# EAGLE design BTP_sensors_and_outputs_V1 (EAGLE 7.7.0)
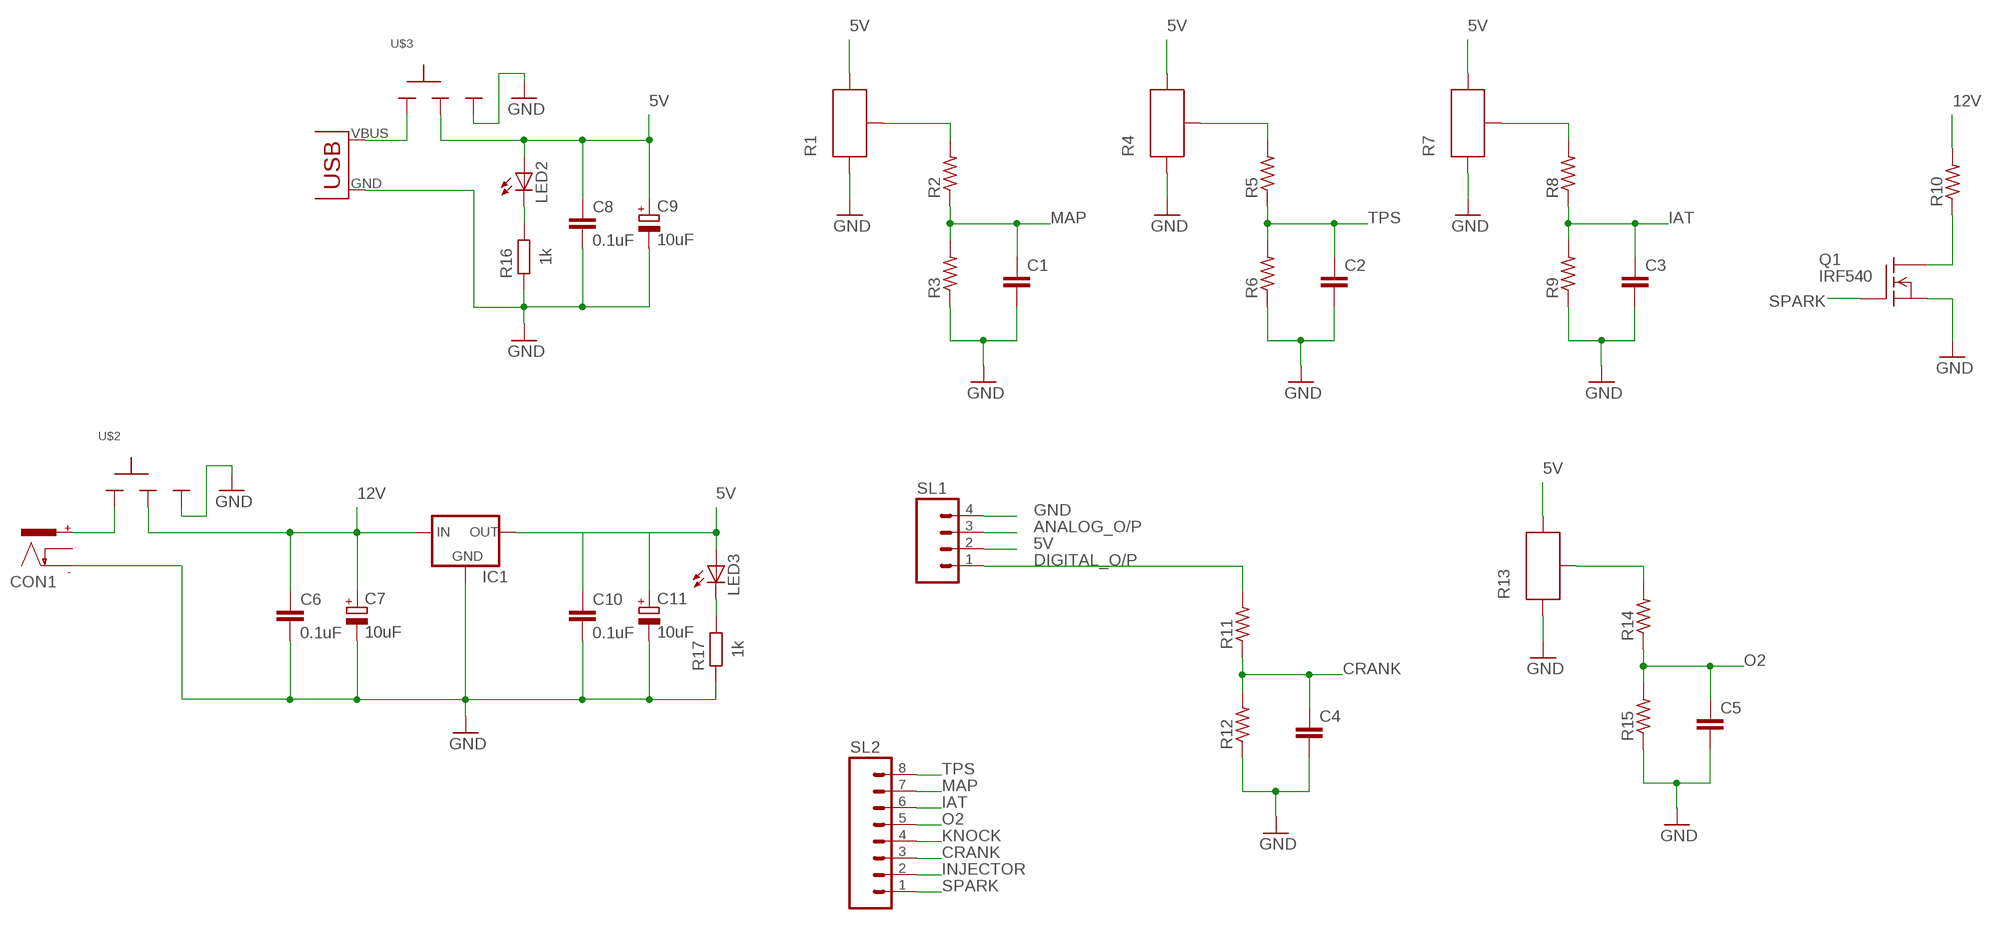
[diagram p0: schematic, sheet 1]

## Parts
C1  CAPACITOR-NON_POLAR025-025X050  [C025-025X050]
C2  CAPACITOR-NON_POLAR025-025X050  [C025-025X050]
C3  CAPACITOR-NON_POLAR025-025X050  [C025-025X050]
C4  CAPACITOR-NON_POLAR025-025X050  [C025-025X050]
C5  CAPACITOR-NON_POLAR025-025X050  [C025-025X050]
C6  0.1uF  C-EU025-025X050  [C025-025X050]
C7  10uF  CPOL-EUE2.5-5  [E2,5-5]
C8  0.1uF  C-EU025-025X050  [C025-025X050]
C9  10uF  CPOL-EUE2.5-5  [E2,5-5]
C10  0.1uF  C-EU025-025X050  [C025-025X050]
C11  10uF  CPOL-EUE2.5-5  [E2,5-5]
CON1  POWER_CON  [NEB21R]
IC1  V_REG_78XXSINK  [TO220-IGO]
LED2  LED3MM  [LED3MM]
LED3  LED3MM  [LED3MM]
Q1  IRF540  [TO220]
R1  POTNORMAL  [RJ9W]
R2  RESISTOR-1/8W  [0204/7]
R3  RESISTOR-1/8W  [0204/7]
R4  POTNORMAL  [RJ9W]
R5  RESISTOR-1/8W  [0204/7]
R6  RESISTOR-1/8W  [0204/7]
R7  POTNORMAL  [RJ9W]
R8  RESISTOR-1/8W  [0204/7]
R9  RESISTOR-1/8W  [0204/7]
R10  RESISTOR-1/8W  [0204/7]
R11  RESISTOR-1/8W  [0204/7]
R12  RESISTOR-1/8W  [0204/7]
R13  POTNORMAL  [RJ9W]
R14  RESISTOR-1/8W  [0204/7]
R15  RESISTOR-1/8W  [0204/7]
R16  1k  R-EU_0204/7  [0204/7]
R17  1k  R-EU_0204/7  [0204/7]
SL1  M04  [04P]
SL2  M08  [08P]
U$2  SLIDESWITCH-BIG  [BIGSWITCH]
U$3  SLIDESWITCH-BIG  [BIGSWITCH]
U$4  USB-POWER  [MINI-USB-POWER]

## Nets
5V: C8.1 C9.+ IC1.OUT LED2.A LED3.A R1.A R4.A R7.A R13.A SL1.2 U$3.2
12V: C6.1 C7.+ IC1.IN R10.2 U$2.2
12V1: C10.1 C11.+
ANALOG_O/P: SL1.3
CRANK: C4.1 R11.1 R12.2 SL2.3
DIGITAL_O/P: R11.2 SL1.1
GND: C1.2 C2.2 C3.2 C4.2 C5.2 C6.2 C7.- C8.2 C9.- C10.2 C11.- CON1.- IC1.GND Q1.3(S) R1.E R3.1 R4.E R6.1 R7.E R9.1 R12.1 R13.E R15.1 R16.2 R17.2 SL1.4 U$2.3 U$3.3 U$4.GND
IAT: C3.1 R8.1 R9.2 SL2.6
INJECTOR: SL2.2
KNOCK: SL2.4
MAP: C1.1 R2.1 R3.2 SL2.7
N$1: R4.S R5.2
N$2: R7.S R8.2
N$3: Q1.2(D) R10.1
N$4: R13.S R14.2
N$5: R1.S R2.2
N$6: CON1.+ U$2.1
N$7: U$3.1 U$4.VBUS(VCC)
N$8: LED2.K(C) R16.1
N$9: LED3.K(C) R17.1
O2: C5.1 R14.1 R15.2 SL2.5
SPARK: Q1.1(G) SL2.1
TPS: C2.1 R5.1 R6.2 SL2.8
Unconnected: CON1.C

## Library data of the parts
C1-C5 = MSP PROJECT LIBRARY:CAPACITOR-NON_POLAR: CAPACITOR, European symbol
C6 C8 C10 = rcl:C-EU: CAPACITOR, European symbol
C7 C9 C11 = rcl:CPOL-EU: POLARIZED CAPACITOR, European symbol
CON1 = CEDT_JANUARY_2015_v5:POWER_CON: DC Power Connector
IC1 = SparkFun-PowerIC:V_REG_78XX: Voltage Regulator Standard 7805 5V regulator. IGO (Input Ground Output). Spark Fun Electronics SKU : COM-00107
LED2 LED3 = CEDT_JANUARY_2015_v5:LED
Q1 = transistor-fet:IRF540: N-Channel Enhancement MOSFET (HEXFET); 100V; 28A; 0,077Ohm
R1 R4 R7 R13 = MSP PROJECT LIBRARY:POT
R2 R3 R5 R6 R8-R12 R14 R15 = MSP PROJECT LIBRARY:RESISTOR: RESISTOR, European symbol
R16 R17 = rcl:R-EU_: RESISTOR, European symbol
SL1 = con-amp-quick:M04: AMP QUICK CONNECTOR; OC_FARNELL: unknown; OC_NEWARK: unknown
SL2 = con-amp-quick:M08: AMP QUICK CONNECTOR; OC_FARNELL: unknown; OC_NEWARK: unknown
U$2 U$3 = CEDT_JANUARY_2015_v5:SLIDESWITCH
U$4 = MSP PROJECT LIBRARY:USB-POWER

## Net classes
0 default: width 0.305 mm, clearance 0.203 mm
1 power: width 0.406 mm, clearance 0.203 mm

## Board
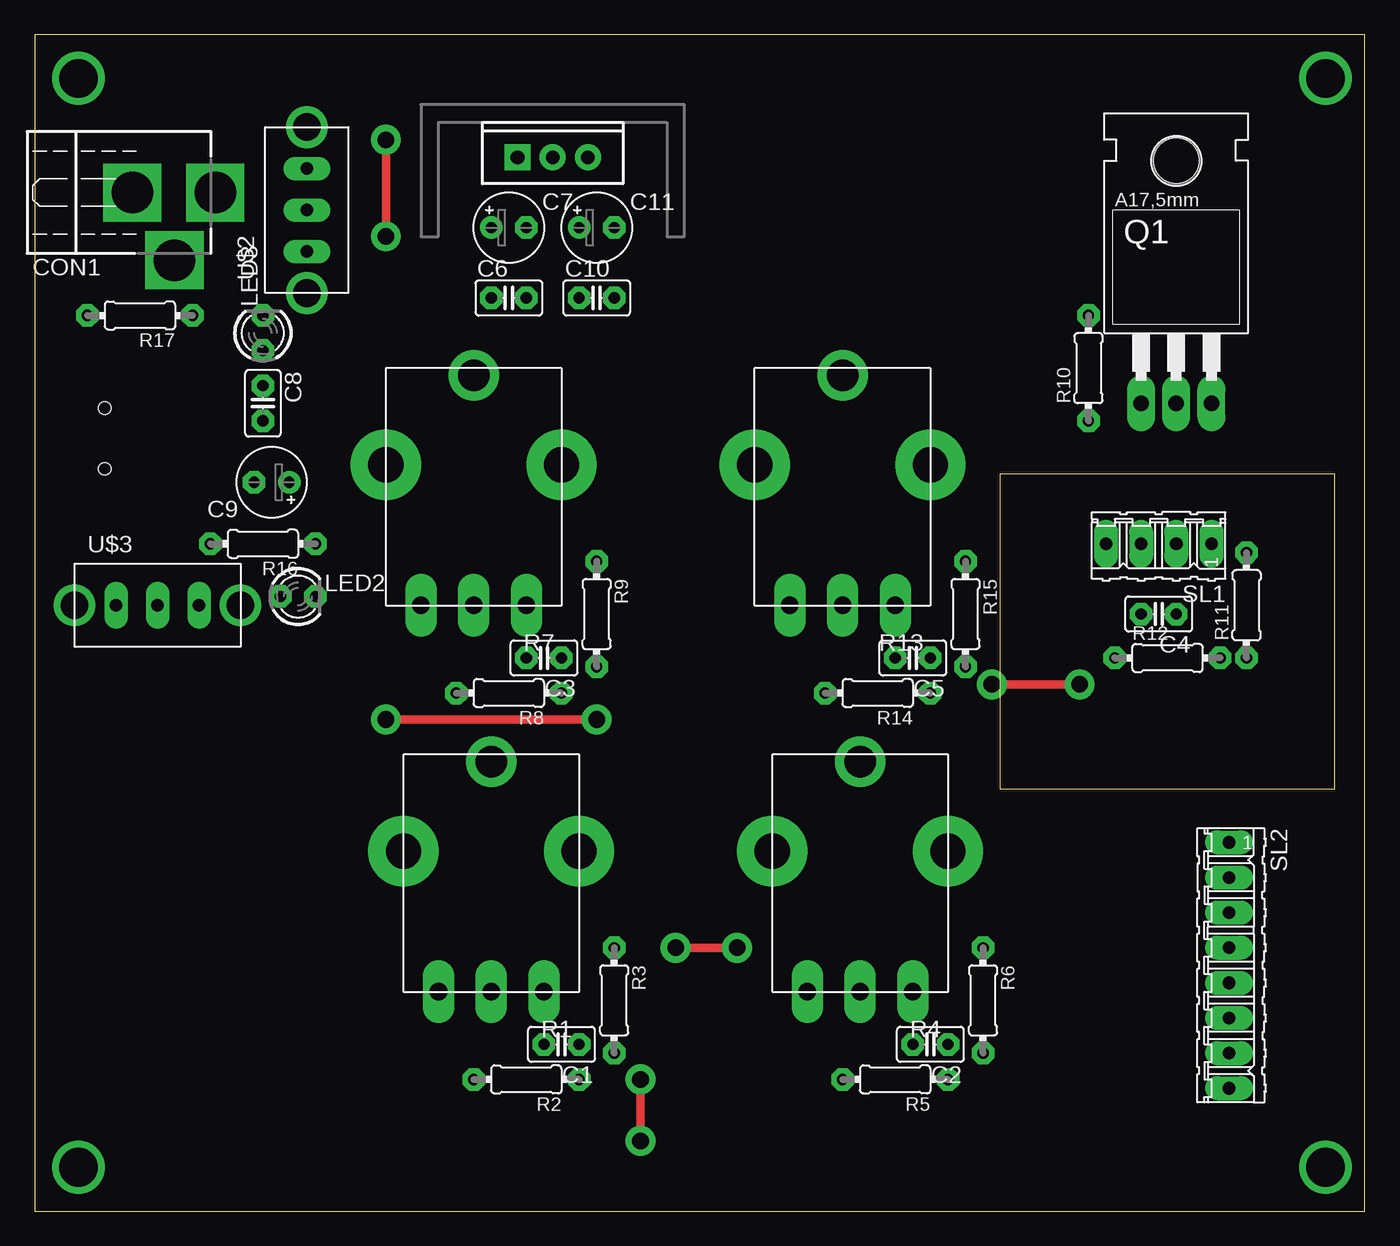
[diagram p1: board, top side]
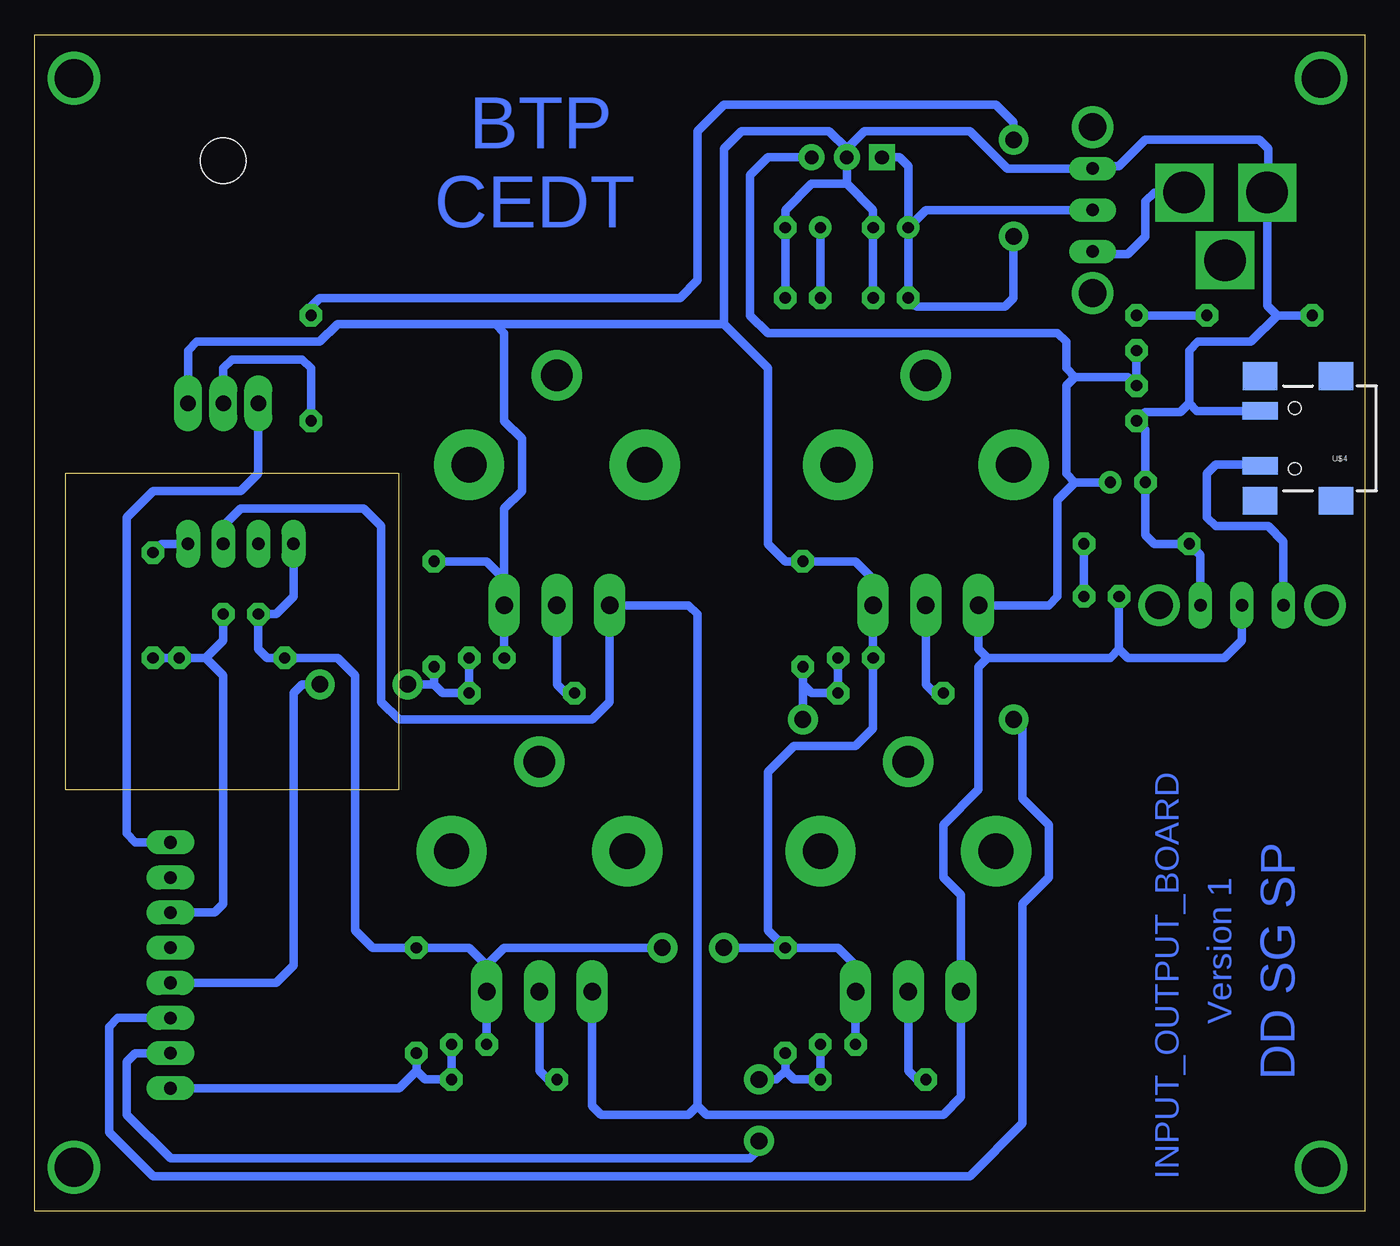
[diagram p2: board, bottom side, seen from below]

Size 96.19 x 85.08 mm. Coordinates in mm from the lower left corner, seen from the top.
Outline: 0,0 96.19,0 96.19,85.08 0,85.08 0,0
Copper layers (1*16): Top 0.035mm / dielectric 1.5mm / Bottom 0.035mm
Design rules "default *": minimum track width 10mil, minimum drill 24mil, track to track 14mil, track to pad 14mil, pad to pad 14mil, via to via 14mil, smd to smd 8mil, copper to edge 40mil, drill to drill 8mil, minimum pad ring 16mil, minimum via ring 16mil, stop-mask expansion 4mil, vias tented up to drill 0mil, thermal gap 10mil

### Footprints (pad centres in the part's own frame; a part is rotated, then mirrored left to right if it is on the bottom)
C025-025X050 = drill 0.813 octagon: 1 -1.27,0; 2 1.27,0
E2,5-5 = drill 0.813 pad 1.6: + -1.27,0 | drill 0.813 pad 1.6 octagon: - 1.27,0
NEB21R = drill 3 pad 4.2 square: + 0,3.54; - 0,-2.46; C 4.9,0.59
TO220-IGO = drill 1 pad 1.88: GND 0,0; OUT 2.54,0 | drill 1 pad 1.88 square: IN -2.54,0
LED3MM = drill 0.813 octagon: A -1.27,0; K 1.27,0
TO220 = drill 1.118 long: 1 -2.54,-6.35; 2 0,-6.35; 3 2.54,-6.35 | hole 3.302: 0,11.176
RJ9W = drill 1.27 long: A 3.81,8.255; E -3.81,8.255; S 0,8.255 | drill 2.286 pad 3.658: P$1 0,-8.382 | drill 2.54 pad 5.08: P$3 6.35,-1.905; P$4 -6.35,-1.905
0204/7 = drill 0.813 octagon: 1 -3.81,0; 2 3.81,0
04P = drill 0.914 long: 1 -3.81,0; 2 -1.27,0; 3 1.27,0; 4 3.81,0
08P = drill 0.914 long: 1 -8.89,0; 2 -6.35,0; 3 -3.81,0; 4 -1.27,0; 5 1.27,0; 6 3.81,0; 7 6.35,0; 8 8.89,0
BIGSWITCH = drill 0.9 long: 1 -3,0; 2 0,0; 3 3,0 | drill 2 pad 2.184: TAB1 -6,0; TAB2 6,0
MINI-USB-POWER = smd 2.54 x 1.27: GND 2.5,-1.981; VBUS 2.5,1.981 | smd 2.5 x 2: GND@1 -3,-4.5; GND@2 -3,4.5; GND@3 2.5,4.5; GND@4 2.5,-4.5 | hole 0.9: 0,2.2; 0,-2.2

### Placement (x,y rotation side)
C1  38.1,12.06 180 top
C2  64.77,12.06 180 top
C3  36.83,40.01 180 top
C4  81.28,43.18 180 top
C5  63.5,40.01 180 top
C6  34.29,66.04 0 top
C7  34.29,71.12 0 top
C8  16.51,58.42 270 top
C9  17.14,52.7 180 top
C10  40.64,66.04 0 top
C11  40.64,71.12 0 top
CON1  9.53,73.66 270 top
IC1  37.47,76.2 0 top
LED2  19.05,44.45 0 top
LED3  16.51,63.5 90 top
Q1  82.55,64.77 0 top
R1  33.02,24.13 180 top
R2  35.56,9.53 180 top
R3  41.91,15.24 270 top
R4  59.69,24.13 180 top
R5  62.23,9.53 180 top
R6  68.58,15.24 270 top
R7  31.75,52.07 180 top
R8  34.29,37.47 180 top
R9  40.64,43.18 270 top
R10  76.2,60.96 90 top
R11  87.63,43.81 90 top
R12  81.92,40.01 0 top
R13  58.42,52.07 180 top
R14  60.96,37.47 180 top
R15  67.31,43.18 270 top
R16  16.51,48.26 180 top
R17  7.62,64.77 180 top
SL1  81.28,48.26 180 top
SL2  86.36,17.78 270 top
U$2  19.68,72.39 90 top
U$3  8.89,43.81 0 top
U$4  5.08,55.88 180 bottom

### Tracks (layer width: path | path; a pad name or v marks a point on that pad's centre or on a via)
5V
  Bottom 0.61: LED3.A C8.1 17.14,60.33 20.95,60.33 | IC1.OUT 43.18,76.2 44.45,74.93 44.45,64.77 43.18,63.5 22.23,63.5 21.59,62.87 21.59,60.96 20.95,60.33 | R7.A 27.94,43.18 | 27.94,43.18 27.94,40.64 27.3,40.01 | 48.26,7.62 48.26,43.18 48.9,43.81 R13.A 54.61,36.83 55.88,35.56 69.85,35.56 71.12,36.83 71.12,49.53 72.39,50.8 81.28,50.8 82.55,49.53 SL1.2 | C9.+ 20.95,52.7 | 20.95,52.7 22.23,51.44 22.23,44.45 22.86,43.81 27.3,43.81 27.94,43.18 | U$3.2 8.89,41.27 10.16,40.01 17.14,40.01 17.78,40.64 | LED2.A 17.78,40.64 | 17.78,40.64 18.41,40.01 27.3,40.01 | 20.95,52.7 21.59,53.34 21.59,59.69 20.95,60.33 | 27.3,40.01 27.94,39.37 27.94,30.48 30.48,27.94 30.48,24.13 29.21,22.86 R1.A 29.21,8.26 30.48,6.99 47.62,6.99 48.26,7.62 | 48.26,7.62 48.9,6.99 55.24,6.99 55.88,7.62 R4.A
12V  (via drill 1.2 pad 1.68)
  Top 0.61: v25.4,77.47 v25.4,70.48
  Bottom 0.61: C7.+ C6.1 32.38,65.41 26.04,65.41 25.4,66.04 v25.4,70.48 | C7.+ 33.02,75.56 33.66,76.2 IC1.IN | U$2.2 31.75,72.39 C7.+ | v25.4,77.47 25.4,78.74 26.67,80.01 46.35,80.01 48.26,78.11 48.26,67.31 49.53,66.04 75.56,66.04 76.2,65.41 R10.2
12V1
  Bottom 0.61: C11.+ C10.1
CRANK
  Bottom 0.61: R11.1 R12.2 83.82,40.01 | C4.1 82.55,41.27 83.82,40.01 | 83.82,40.01 82.55,38.73 82.55,22.23 83.19,21.59 SL2.3
DIGITAL_O/P
  Bottom 0.61: SL1.1 87,48.26 R11.2
GND  (via drill 1.2 pad 1.68)
  Top 0.61: v50.8,19.05 v46.35,19.05
  Bottom 0.61: C6.2 C7.- 35.56,72.39 37.47,74.3 | C10.2 C11.- 41.91,72.39 40.01,74.3 37.47,74.3 | R3.1 38.1,19.05 36.83,17.78 R1.E C1.2 | 63.5,17.78 R4.E C2.2 | U$2.3 19.23,75.39 | 6.35,64.77 R17.2 | U$4.GND 12.14,57.86 12.7,58.42 | 12.7,58.42 12.7,62.23 12.06,62.87 8.26,62.87 6.35,64.77 | 12.7,58.42 13.34,57.78 15.88,57.78 C8.2 15.88,56.52 C9.- 15.88,48.9 15.24,48.26 R16.2 11.89,47.45 U$3.3 | 6.35,64.77 7.07,65.48 CON1.- 6.99,73.74 6.99,76.83 7.62,77.47 15.88,77.47 17.78,75.56 19.51,75.56 U$2.3 | U$2.3 25.86,75.39 28.57,78.11 36.2,78.11 37.47,76.83 | 37.47,76.83 IC1.GND 37.47,74.3 | 37.47,76.83 38.73,78.11 45.09,78.11 46.35,76.83 46.35,64.14 | R3.1 43.18,20.32 43.18,31.75 41.27,33.66 36.83,33.66 35.56,34.92 C3.2 R7.E 35.56,45.72 36.83,46.99 R9.1 41.91,46.99 43.18,48.26 43.18,60.96 46.35,64.14 | C5.2 R13.E 62.23,45.72 | Q1.3 85.09,62.23 84.45,62.87 75.56,62.87 74.3,64.14 62.87,64.14 | 46.35,64.14 62.87,64.14 | 62.23,45.72 63.5,46.99 R15.1 | SL1.4 77.47,44.45 78.74,43.18 C4.2 80.01,40.64 79.38,40.01 R12.1 74.3,40.01 73.03,38.73 73.03,20.32 71.75,19.05 R6.1 64.77,19.05 63.5,17.78 | 62.87,64.14 62.23,63.5 62.23,57.15 60.96,55.88 60.96,52.07 62.23,50.8 62.23,45.72 | 63.5,17.78 62.23,19.05 v50.8,19.05 | v46.35,19.05 R3.1
IAT  (via drill 1.2 pad 1.68)
  Top 0.61: v25.4,35.56 v40.64,35.56
  Bottom 0.61: 40.64,38.1 40.01,37.47 R8.1 C3.1 | 40.64,38.1 R9.2 | v25.4,35.56 24.77,34.92 24.77,29.84 22.86,27.94 22.86,24.13 24.77,22.23 24.77,6.35 28.57,2.54 87.63,2.54 90.81,5.71 90.81,13.34 90.17,13.97 SL2.6 | v40.64,35.56 40.64,38.1
MAP  (via drill 1.2 pad 1.68)
  Top 0.61: v43.81,5.08 v43.81,9.53
  Bottom 0.61: C1.1 R2.1 41.27,9.53 41.91,10.16 | R3.2 41.91,10.16 | 41.91,10.16 42.55,9.53 v43.81,9.53 | v43.81,5.08 43.81,4.45 44.45,3.81 86.36,3.81 89.53,6.99 89.53,10.79 88.9,11.43 SL2.7
N$1
  Bottom 0.61: R4.S 59.69,10.16 59.05,9.53 R5.2
N$2
  Bottom 0.61: R7.S 31.75,38.1 31.11,37.47 R8.2
N$3
  Bottom 0.61: R10.1 76.2,60.96 76.83,61.59 81.92,61.59 82.55,60.96 Q1.2
N$4
  Bottom 0.61: R13.S 58.42,38.1 57.78,37.47 R14.2
N$5
  Bottom 0.61: R1.S 33.02,10.16 32.38,9.53 R2.2
N$6
  Bottom 0.61: CON1.+ 15.24,73.66 15.88,73.03 15.88,70.48 17.14,69.22 19.51,69.22 U$2.1
N$7
  Bottom 0.61: U$3.1 5.89,48.44 6.99,49.53 10.79,49.53 11.43,50.16 11.43,53.34 10.79,53.98 7.66,53.98 U$4.VBUS
N$8
  Bottom 0.61: LED2.K R16.1
N$9
  Bottom 0.61: R17.1 LED3.K
N$10  (via drill 2.8 pad 3.81)
  other vias: 3.17,81.92
N$11  (via drill 2.8 pad 3.81)
  other vias: 93.34,81.92
N$12  (via drill 2.8 pad 3.81)
  other vias: 93.34,3.17
N$13  (via drill 2.8 pad 3.81)
  other vias: 3.17,3.17
O2  (via drill 1.2 pad 1.68)
  Top 0.61: v69.22,38.1 v75.56,38.1
  Bottom 0.61: C5.1 R14.1 66.67,37.47 67.31,38.1 | R15.2 67.31,38.1 | 67.31,38.1 v69.22,38.1 | v75.56,38.1 76.83,38.1 77.47,37.47 77.47,17.78 78.74,16.51 SL2.5
SPARK
  Bottom 0.61: Q1.1 80.01,53.34 81.28,52.07 87.63,52.07 89.53,50.16 89.53,27.3 88.9,26.67 SL2.1
TPS
  Bottom 0.61: C2.1 R5.1 67.94,9.53 68.58,10.16 | R6.2 68.58,10.16 | SL2.8 69.85,8.89 68.58,10.16

### Text on the board
Bottom: BTP | CEDT | INPUT_OUTPUT_BOARD | DD SG SP | Version 1